# Altium schematic sheet Optocoupler_STM32.SchDoc
size A4; SheetNumber: 1; SheetTotal: 2
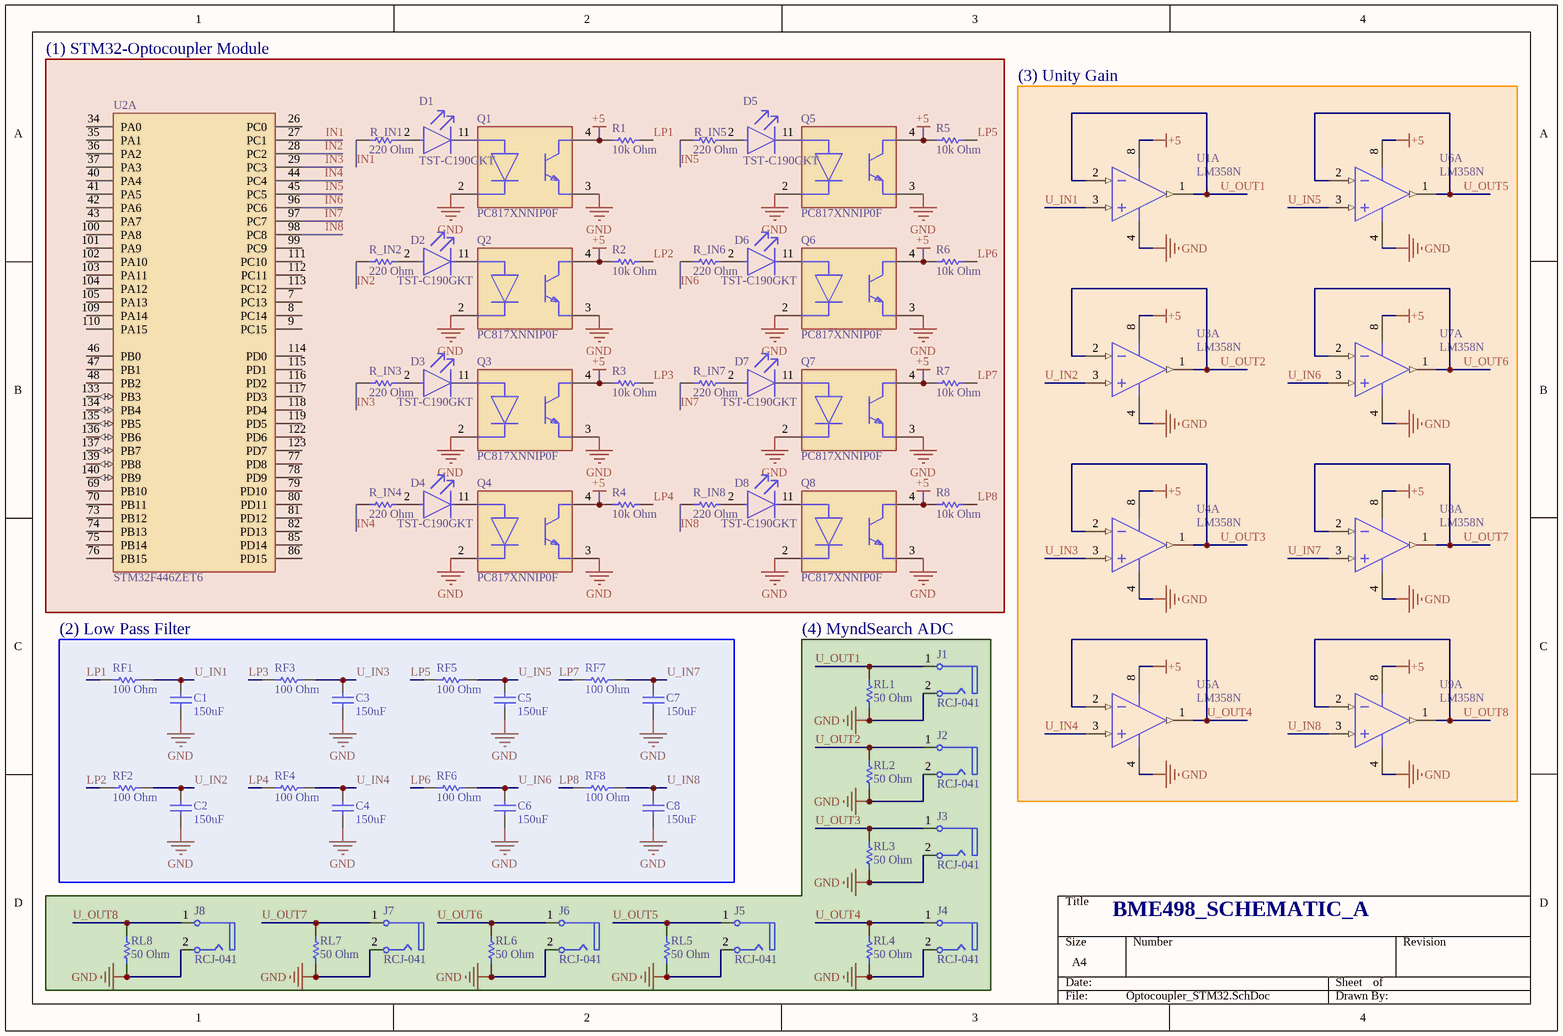
[diagram p0: Optocoupler_STM32.SchDoc]

## Parts
C1  value 150uF  [RADIAL-0.1]
C2  value 150uF  [RADIAL-0.1]
C3  value 150uF  [RADIAL-0.1]
C4  value 150uF  [RADIAL-0.1]
C5  value 150uF  [RADIAL-0.1]
C6  value 150uF  [RADIAL-0.1]
C7  value 150uF  [RADIAL-0.1]
C8  value 150uF  [RADIAL-0.1]
D1  TST-C190GKT  [FP-LTST-C190GKT-MFG]
D2  TST-C190GKT  [FP-LTST-C190GKT-MFG]
D3  TST-C190GKT  [FP-LTST-C190GKT-MFG]
D4  TST-C190GKT  [FP-LTST-C190GKT-MFG]
D5  TST-C190GKT  [FP-LTST-C190GKT-MFG]
D6  TST-C190GKT  [FP-LTST-C190GKT-MFG]
D7  TST-C190GKT  [FP-LTST-C190GKT-MFG]
D8  TST-C190GKT  [FP-LTST-C190GKT-MFG]
J1  RCJ-041  [CUI-RCJ-041_V]
J2  RCJ-041  [CUI-RCJ-041_V]
J3  RCJ-041  [CUI-RCJ-041_V]
J4  RCJ-041  [CUI-RCJ-041_V]
J5  RCJ-041  [CUI-RCJ-041_V]
J6  RCJ-041  [CUI-RCJ-041_V]
J7  RCJ-041  [CUI-RCJ-041_V]
J8  RCJ-041  [CUI-RCJ-041_V]
Q1  PC817XNNIP0F  [FP-PC817XNNIP0F-MFG]
Q2  PC817XNNIP0F  [FP-PC817XNNIP0F-MFG]
Q3  PC817XNNIP0F  [FP-PC817XNNIP0F-MFG]
Q4  PC817XNNIP0F  [FP-PC817XNNIP0F-MFG]
Q5  PC817XNNIP0F  [FP-PC817XNNIP0F-MFG]
Q6  PC817XNNIP0F  [FP-PC817XNNIP0F-MFG]
Q7  PC817XNNIP0F  [FP-PC817XNNIP0F-MFG]
Q8  PC817XNNIP0F  [FP-PC817XNNIP0F-MFG]
R1  value 10k Ohm  [AXIAL-0.3]
R2  value 10k Ohm  [AXIAL-0.3]
R3  value 10k Ohm  [AXIAL-0.3]
R4  value 10k Ohm  [AXIAL-0.3]
R5  value 10k Ohm  [AXIAL-0.3]
R6  value 10k Ohm  [AXIAL-0.3]
R7  value 10k Ohm  [AXIAL-0.3]
R8  value 10k Ohm  [AXIAL-0.3]
R_IN1  value 220 Ohm  [AXIAL-0.3]
R_IN2  value 220 Ohm  [AXIAL-0.3]
R_IN3  value 220 Ohm  [AXIAL-0.3]
R_IN4  value 220 Ohm  [AXIAL-0.3]
R_IN5  value 220 Ohm  [AXIAL-0.3]
R_IN6  value 220 Ohm  [AXIAL-0.3]
R_IN7  value 220 Ohm  [AXIAL-0.3]
R_IN8  value 220 Ohm  [AXIAL-0.3]
RF1  value 100 Ohm  [AXIAL-0.3]
RF2  value 100 Ohm  [AXIAL-0.3]
RF3  value 100 Ohm  [AXIAL-0.3]
RF4  value 100 Ohm  [AXIAL-0.3]
RF5  value 100 Ohm  [AXIAL-0.3]
RF6  value 100 Ohm  [AXIAL-0.3]
RF7  value 100 Ohm  [AXIAL-0.3]
RF8  value 100 Ohm  [AXIAL-0.3]
RL1  value 50 Ohm  [AXIAL-0.3]
RL2  value 50 Ohm  [AXIAL-0.3]
RL3  value 50 Ohm  [AXIAL-0.3]
RL4  value 50 Ohm  [AXIAL-0.3]
RL5  value 50 Ohm  [AXIAL-0.3]
RL6  value 50 Ohm  [AXIAL-0.3]
RL7  value 50 Ohm  [AXIAL-0.3]
RL8  value 50 Ohm  [AXIAL-0.3]
U1  LM358N  [ONSC-PDIP-8-626-05_M]  (part A of 2)
U2  STM32F446ZET6  [FP-STM32F446ZET6-MFG]  (part A of 3)
U3  LM358N  [ONSC-PDIP-8-626-05_M]  (part A of 2)
U4  LM358N  [ONSC-PDIP-8-626-05_M]  (part A of 2)
U5  LM358N  [ONSC-PDIP-8-626-05_M]  (part A of 2)
U6  LM358N  [ONSC-PDIP-8-626-05_M]  (part A of 2)
U7  LM358N  [ONSC-PDIP-8-626-05_M]  (part A of 2)
U8  LM358N  [ONSC-PDIP-8-626-05_M]  (part A of 2)
U9  LM358N  [ONSC-PDIP-8-626-05_M]  (part A of 2)

## Blocks framed on the sheet
(1) STM32-Optocoupler Module: D1-D8 Q1-Q8 R1-R8 R_IN1-R_IN8 U2
(3) Unity Gain: U1 U3-U9
(2) Low Pass Filter: C1-C8 RF1-RF8

## Nets
+5: Q1.4(C) Q2.4(C) Q3.4(C) Q4.4(C) Q5.4(C) Q6.4(C) Q7.4(C) Q8.4(C) R1.1 R2.1 R3.1 R4.1 R5.1 R6.1 R7.1 R8.1 U1.8(VCC) U3.8(VCC) U4.8(VCC) U5.8(VCC) U6.8(VCC) U7.8(VCC) U8.8(VCC) U9.8(VCC)
GND: C1.1 C2.1 C3.1 C4.1 C5.1 C6.1 C7.1 C8.1 J1.2 J2.2 J3.2 J4.2 J5.2 J6.2 J7.2 J8.2 Q1.2(C) Q1.3(E) Q2.2(C) Q2.3(E) Q3.2(C) Q3.3(E) Q4.2(C) Q4.3(E) Q5.2(C) Q5.3(E) Q6.2(C) Q6.3(E) Q7.2(C) Q7.3(E) Q8.2(C) Q8.3(E) RL1.1 RL2.1 RL3.1 RL4.1 RL5.1 RL6.1 RL7.1 RL8.1 U1.4(VEE/GND) U3.4(VEE/GND) U4.4(VEE/GND) U5.4(VEE/GND) U6.4(VEE/GND) U7.4(VEE/GND) U8.4(VEE/GND) U9.4(VEE/GND)
IN1: R_IN1.2 U2.27(PC1)
IN2: R_IN2.2 U2.28(PC2)
IN3: R_IN3.2 U2.29(PC3)
IN4: R_IN4.2 U2.44(PC4)
IN5: R_IN5.2 U2.45(PC5)
IN6: R_IN6.2 U2.96(PC6)
IN7: R_IN7.2 U2.97(PC7)
IN8: R_IN8.2 U2.98(PC8)
LP1: R1.2 RF1.1
LP2: R2.2 RF2.1
LP3: R3.2 RF3.1
LP4: R4.2 RF4.1
LP5: R5.2 RF5.1
LP6: R6.2 RF6.1
LP7: R7.2 RF7.1
LP8: R8.2 RF8.1
U_IN1: C1.2 RF1.2 U1.3(INA+)
U_IN2: C2.2 RF2.2 U3.3(INA+)
U_IN3: C3.2 RF3.2 U4.3(INA+)
U_IN4: C4.2 RF4.2 U5.3(INA+)
U_IN5: C5.2 RF5.2 U6.3(INA+)
U_IN6: C6.2 RF6.2 U7.3(INA+)
U_IN7: C7.2 RF7.2 U8.3(INA+)
U_IN8: C8.2 RF8.2 U9.3(INA+)
U_OUT1: J1.1 RL1.2 U1.1(OUTA) U1.2(INA-)
U_OUT2: J2.1 RL2.2 U3.1(OUTA) U3.2(INA-)
U_OUT3: J3.1 RL3.2 U4.1(OUTA) U4.2(INA-)
U_OUT4: J4.1 RL4.2 U5.1(OUTA) U5.2(INA-)
U_OUT5: J5.1 RL5.2 U6.1(OUTA) U6.2(INA-)
U_OUT6: J6.1 RL6.2 U7.1(OUTA) U7.2(INA-)
U_OUT7: J7.1 RL7.2 U8.1(OUTA) U8.2(INA-)
U_OUT8: J8.1 RL8.2 U9.1(OUTA) U9.2(INA-)
NetD1_1: D1.1(C) Q1.1(A)
NetD1_2: D1.2(A) R_IN1.1
NetD3_1: D3.1(C) Q3.1(A)
NetD3_2: D3.2(A) R_IN3.1
NetD5_1: D5.1(C) Q5.1(A)
NetD5_2: D5.2(A) R_IN5.1
NetD7_1: D7.1(C) Q7.1(A)
NetD7_2: D7.2(A) R_IN7.1

Not connected (* = marked no-connect by the designer): D2 1(C) 2(A); D4 1(C) 2(A); D6 1(C) 2(A); D8 1(C) 2(A); Q2 1(A); Q4 1(A); Q6 1(A); Q8 1(A); R_IN2 1; R_IN4 1; R_IN6 1; R_IN8 1; U2 7(PC13) 8(PC14) 9(PC15) 26(PC0) 34(PA0) 35(PA1) 36(PA2) 37(PA3) 40(PA4) 41(PA5) 42(PA6) 43(PA7) 46(PB0) 47(PB1) 48(PB2) 69(PB10) 70(PB11) 73(PB12) 74(PB13) 75(PB14) 76(PB15) 77(PD8) 78(PD9) 79(PD10) 80(PD11) 81(PD12) 82(PD13) 85(PD14) 86(PD15) 99(PC9) 100(PA8) 101(PA9) 102(PA10) 103(PA11) 104(PA12) 105(PA13) 109(PA14) 110(PA15) 111(PC10) 112(PC11) 113(PC12) 114(PD0) 115(PD1) 116(PD2) 117(PD3) 118(PD4) 119(PD5) 122(PD6) 123(PD7) 133(PB3) 134(PB4) 135(PB5) 136(PB6) 137(PB7) 139(PB8) 140(PB9)

## Notes on the sheet
- (4) MyndSearch ADC
- BME498_SCHEMATIC_A

## Library data of the parts
C1-C8 = CAP ALUM 15UF 20% 16V RADIAL: Capacitor; Manufacturer Part Number: EEA-GA1C150B; Designator: C?; Voltage Rating: 16V; Published: 8-Jun-2000; LatestRevisionDate: 17-Jul-2002; LatestRevisionNote: Re-released for DXP Platform.; Publisher: Altium Limited
D1-D8 = CMP-22017-000005-2: LED GREEN CLEAR CHIP SMD; Dominant Wavelength: 569nm; Reverse Voltage: 5V; Lens Color: Colorless; Viewing Angle: 130°; Voltage: 2V; Forward Current: 30mA; Power Dissipation: 100mW; Luminous Intensity: 6mcd; Number of LEDs: 1; Forward Voltage: 2.1V; Wavelength: 565nm; Test Current: 10mA; Min Operating Temperature: -55°C; Lens Style: Clear; Mount: Surface Mount; Width: 0.8mm; Packaging: Tape and Reel; Lens Transparency: Clear; Case Code (Metric): 1608; Depth: 0.8mm; Case Code (Imperial): 0603; Case/Package: 0603; Number of Pins: 2; Max Operating Temperature: 85°C; Lead Free: Lead Free; Number of Elements: 1; Length: 1.6mm; Height: 0.8mm; Package Quantity: 1; Power Rating: 100mW; Radiation Hardening: No; Illumination Color: Green; Color: Green
J1-J8 = CMP-1692-00002-1: Female RCJ Jack, 2 Position, Height 11.724 mm, Tail Length 4 mm, RoHS, Bulk; Case\Package: Metal; Connector Type: HDMI; Current Rating: 500 mA; Voltage Rating: 40 V; Length: 16.2 mm; Pins: 19; ComponentLink1URL: http://www.cui.com/; ComponentLink1Description: Manufacturer URL; Packaging: Tape and Reel; Lead Pitch: 0.5 mm; PackageDescription: Female RCJ Jack, 2 Position, Height 11.724 mm, Tail Length 4 mm; RoHSCompliant: true; Min Operating Temperature: -55 degC; Height: 6.1 mm; Contact Material: Copper; REACH SVHC: No SVHC; DatasheetVersion: Rev. B, 02/2012; ComponentLink2Description: Datasheet; Contact Plating: Gold; Colour: Black; Max Operating Temperature: 85 degC; Mount: Surface Mount; Package Quantity: 400; Gender: Female; ComponentLink2URL: http://www.cui.com/product/resource/rcj-04x.pdf; PackageReference: RCJ-041
Q1-Q8 = CMP-65434-000005-1: OPTOISOLATOR 5KV TRANS 4SMD; Reverse Breakdown Voltage: 6V; Output Current per Channel: 30mA; Power Dissipation: 200mW; Collector-emitter Voltage-Max: 200mV; Max Output Voltage: 80V; Input Current: 50mA; Forward Voltage: 1.4V; Fall Time: 18000ns; Number of Elements: 1; Input Type: DC; Packaging: Tape and Reel; RoHS Compliant: Yes; Contact Plating: Copper; Min Operating Temperature: -30°C; Collector Emitter Saturation Voltage: 200mV; Max Input Current: 50mA; Radiation Hardening: No; Max Collector Current: 50mA; Case/Package: SMD/SMT; Mount: Surface Mount; Output Voltage: 80V; Forward Current: 50mA; Max Power Dissipation: 200mW; Collector Emitter Voltage (VCEO): 80V; Number of Channels: 1; Rise Time: 18000ns; Isolation Voltage: 5kV; Number of Pins: 4; Lead Free: Lead Free; Package Quantity: 2000; Isolation Voltage-Max: 5kV; Max Operating Temperature: 100°C
R1-R8 R_IN1-R_IN8 RF1-RF8 RL1-RL8 = RES 10 OHM 5% 1/4W AXIAL: Resistor; Manufacturer Part Number: CFR-25JB-52-10R; Designator: R?; Power Rating: 1/4W; Tolerance: 0.05; Published: 8-Jun-2000; LatestRevisionDate: 17-Jul-2002; LatestRevisionNote: Re-released for DXP Platform.; Publisher: Altium Limited
U1 U3-U9 = CMP-1310-00098-1: Single Supply Dual Operational Amplifier, 3 to 32 V, 0 to 70 degC, 8-Pin PDIP, Tube; Manufacturer: On Semiconductor; VCC Max (V): 32; VCC Min (V): 3; Mounting Technology: Through Hole; ComponentLink3Description: Package Specification; ComponentLink3URL: http://www.onsemi.com/pub_link/Collateral/LM211-D.PDF; RoHS: FALSE; Packing: Tube; PackageDescription: 8-Pin Plastic Dual-In Line Package, Body 9.52 x 6.605 mm, Pitch 2.54 mm; PackageReference: PDIP-8-626-05; PackageVersion: Rev. M, 04/2010; PartNumber: LM358N; ComponentLink2Description: Datasheet; ComponentLink2URL: http://www.onsemi.cn/pub_link/Collateral/LM358-D.PDF; ComponentLink1URL: http://www.onsemi.com/; ComponentLink1Description: Manufacturer URL; DatasheetVersion: Rev. 27
U2 = CMP-12105-000067-1: IC MCU 32BIT 512KB FLASH 144LQFP; Manufacturer: STMicroelectronics; Standoff Height: 0.05mm; Memory Size: 512KBytes; Data Bus Width: 32bits; Number Of Timers/Counters: 14; Number Of I2C Channels: 4; Number Of Usb Channels: 2; Frequency: 180MHz; Ram Size: 128KBytes; Number Of I/Os: 114; Min Supply Voltage: 1.7V; Max Junction Temp: +105°C; Number Of Cores: 1; Core Architecture: Arm Cortex-M4; Max Supply Voltage: 3.6V; Number Of Adc Channels: 24; Number Of Pwm Channels: 32; Number Of Uart Channels: 6; Number Of A/D Converters: 3; Interface: I2C,SPI,UART,USART,EBI/EMI,CAN,USB,LIN,IrDA,I2S,SMBus,Other; Mouser Description: 32 Bit Microcontroller, High Performance, Arm Cortex-M4, 180 Mhz, 512 Kb, 128 Kb, 144, Lqfp; Temperature Range High: +105°C; Device Class L3: Microcontrollers; Ambient Temperature Range High: +85°C; Lead Free: Yes; Octopart: https://octopart.com/stm32f446zet6-stmicroelectronics-52642927; Device Class L2: Embedded Processors and Controllers; Height: 1.6mm; Category: IC; Manufacturer Part Number: STM32F446ZET6; RoHS: TRUE; Memory Type: FLASH; Temperature: -40°C to +105°C; Number Of Spi Channels: 4; Device Class L1: Integrated Circuits (ICs); Package: LQFP144; Digikey Description: IC MCU 32BIT 512KB FLASH 144LQFP; Automotive: No; ComponentLink2Description: Datasheet; ComponentLink2URL: https://www.st.com/content/ccc/resource/technical/document/datasheet/65/cb/75/50/53/d6/48/24/DM00141306.pdf/files/DM00141306.pdf/jcr:content/translations/en.DM00141306.pdf; Ambient Temperature Range Low: -40°C; Temperature Range Low: -40°C